# Altium schematic sheet XbeeModule.SchDoc
size A4
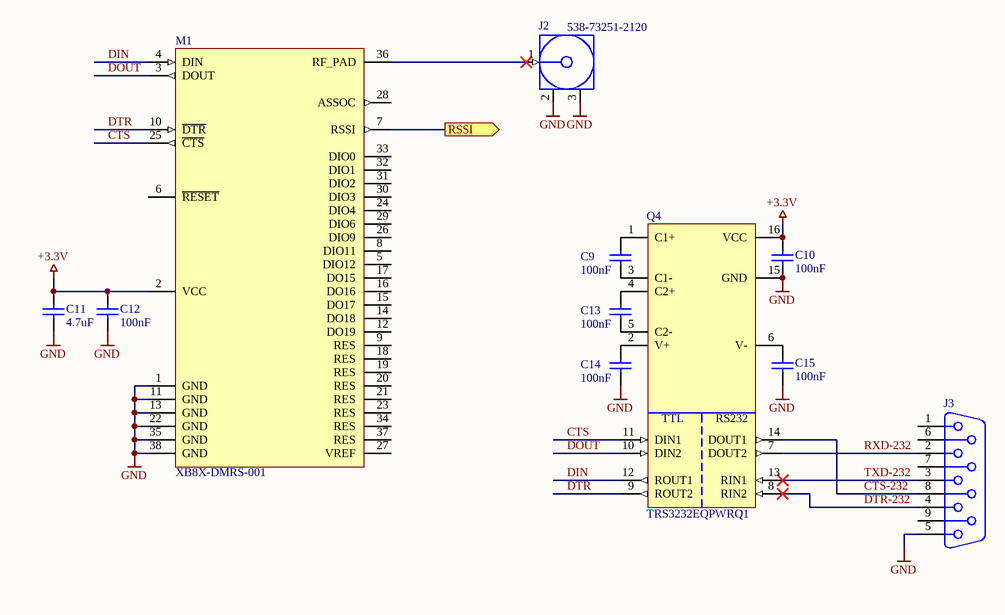
[diagram p0: XbeeModule.SchDoc]

## Parts
C9  value 100nF  [CAPC1608X08N]  (hidden comment: CGA3E2X7R1H104K080AA)
C10  value 100nF  [CAPC1608X08N]  (hidden comment: CGA3E2X7R1H104K080AA)
C11  value 4.7uF  [CAPC2012X14N]  (hidden comment: CGA4J3X5R1H475K125AB)
C12  value 100nF  [CAPC1608X08N]  (hidden comment: CGA3E2X7R1H104K080AA)
C13  value 100nF  [CAPC1608X08N]  (hidden comment: CGA3E2X7R1H104K080AA)
C14  value 100nF  [CAPC1608X08N]  (hidden comment: CGA3E2X7R1H104K080AA)
C15  value 100nF  [CAPC1608X08N]  (hidden comment: CGA3E2X7R1H104K080AA)
J2  Supplier Part Number 1: 538-73251-2120  [MOLEX-SMA-PCB]  (hidden comment: 73251-2120)
J3  DB9 - 2311765-2  [DB9F-PCB-TH]  (value not drawn)
M1  XB8X-DMRS-001  [XBEESX868MOD]
Q4  TRS3232EQPWRQ1  [TSOP65P640X120-16N]

## Ports
RSSI (out)

## Nets
+3.3V: C10.1 C11.2 C12.1 M1.2(VCC) Q4.16(VCC)
GND: C10.2 C11.1 C12.2 C14.2 C15.2 J2.2(GND) J2.3(GND) J3.5 M1.1(GND) M1.11(GND) M1.13(GND) M1.22(GND) M1.35(GND) M1.38(GND) Q4.15(GND)
CTS: M1.25(~{CTS}) Q4.11(DIN1)
CTS-232: J3.8 Q4.14(DOUT1)
DIN: M1.4(DIN) Q4.12(ROUT1)
DOUT: M1.3(DOUT) Q4.10(DIN2)
DTR: M1.10(~{DTR}) Q4.9(ROUT2)
DTR-232: J3.4 Q4.8(RIN2)
RSSI: M1.7(RSSI) ; port RSSI
RXD-232: J3.2 Q4.7(DOUT2)
TXD-232: J3.3 Q4.13(RIN1)
NetC9_1: C9.1 Q4.1(C1+)
NetC9_2: C9.2 Q4.3(C1-)
NetC13_1: C13.1 Q4.4(C2+)
NetC13_2: C13.2 Q4.5(C2-)
NetC14_1: C14.1 Q4.2(V+)
NetC15_1: C15.1 Q4.6(V-)
NetJ2_1: J2.1(Signal) M1.36(RF_PAD)

Not connected (* = marked no-connect by the designer): J3 1 6 7 9; M1 5(DIO12) 6(~{RESET}) 8(DIO11) 9(RES) 12(DO19) 14(DO18) 15(DO17) 16(DO16) 17(DO15) 18(RES) 19(RES) 20(RES) 21(RES) 23(RES) 24(DIO4) 26(DIO9) 27(VREF) 28(ASSOC) 29(DIO6) 30(DIO3) 31(DIO2) 32(DIO1) 33(DIO0) 34(RES) 37(RES)

## Notes on the sheet
- (in symbol TRS3232EQ1) TTL; RS232

## Library data of the parts
C9 C10 C12-C15 = C0603-100nF-50V: 0603 Capacitor, 100nF; Supplier 1: Mouser; Supplier Part Number 1: 810-CGA3E2X7R1H104K
C11 = C0805-4.7uF-50V: 0805 Capacitor, 4.7uF; Supplier 1: Mouser; Supplier Part Number 1: 810-CGA4J3X5R1H475K
J2 = SMA-PCB: RF Coaxial PCB Connector, 50 Ohms, SMA Jack, Edge Mount; PCB_Layout: Complies with manufacturer's recommendation.; DrillSize: Corresponds to nominal value.; Published: 15-Jul-2004; LatestRevisionDate: 15-Jul-2004; LatestRevisionNote: Component Replaced.; DatasheetDocument: 30-May-2003; PackageDocument: 04-Jul-1999; PackageReference: 919-119J-51AX; Publisher: Altium Limited; ComponentLink1Description: Manufacturer Link; ComponentLink1URL: http://www.amphenolrf.com/; Supplier 1: Mouser
J3 = DB9F-PCB: DB9, Female, PCB, TH; PackageDocument: O; Positions: 9; Gender: Receptacle; Published: 15-Jun-2001; LatestRevisionDate: 17-Jul-2002; LatestRevisionNote: Re-released for DXP Platform.; DatasheetDocument: 1-Sep-1999; PackageReference: 788750; Publisher: Altium Limited; Orientation: Right Angle; Supplier 1: Mouser; Supplier Part Number 1: 571-2311765-2
M1 = XBee-SX-868-RFPad: 868 MHz RF module; Supplier 1: Mouser; Supplier Part Number 1: 888-XB8X-DMRS-001
Q4 = TRS3232EQ1: 3-V TO 5.5-V MULTICHANNEL RS-232 LINE DRIVER/RECEIVER WITH ±15-kV IEC ESD PROTECTION; Supplier 1: Mouser; Supplier Part Number 1: 595-TRS3232EQPWRQ1